# Altium schematic sheet 3.3V_1A_LDO_SUPPLY.SchDoc
size A
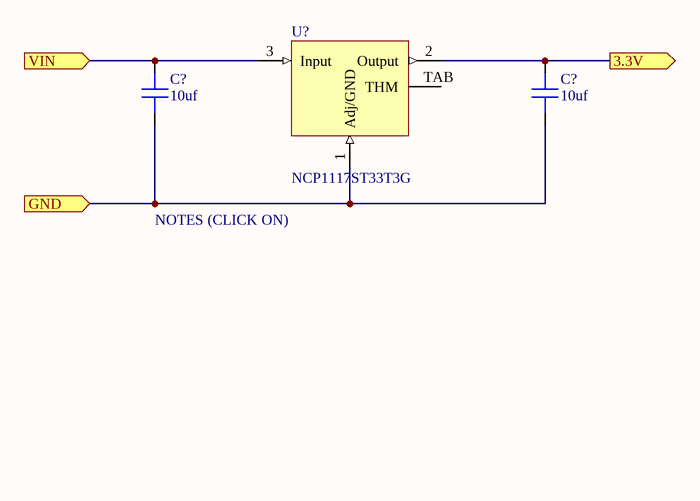
[diagram p0: 3.3V_1A_LDO_SUPPLY.SchDoc]

## Parts
(Parts that share a designator on the sheet are numbered #1, #2 ... from top to bottom, then left to right.)
C?#1  value 10uf  [CAP 0603/1608]  (hidden comment: Capacitor MLCC 10uf 16V CAP 0603/1608)
C?#2  value 10uf  [CAP 0603/1608]  (hidden comment: Capacitor MLCC 10uf 16V CAP 0603/1608)
U?  NCP1117ST33T3G  [SOT-223-3]

## Ports
3.3V (out), GND (in), VIN (in)

## Nets
3.3V: C?#2.2 U?.2(Output) ; port 3.3V
GND: C?#1.1 C?#2.1 U?.1(Adj/GND) ; port GND
VIN: C?#1.2 U?.3(Input) ; port VIN

Not connected (* = marked no-connect by the designer): U? TAB(THM)

## Notes on the sheet
- NOTES (CLICK ON)
- VOUT Stability BEST @ 7V
  Input is variable between 6.5 to 12V.
  DO NOT EXCEED 1A @ 12V
- Frequency compensation for the regulator is provided by capacitor Cout and its use is mandatory to ensure output stability. A minimum capacitance value of 4.7 F with an equivalent series resistance (ESR) that is within the limits of 33 mOhm (typ) to 2.2Ohm is required
- The input bypass capacitor should be mounted with the shortest
  possible track length directly across the regulator’s input
  and ground terminals. A 10 F ceramic or tantalum
  capacitor should be adequate for most applications.
- This series contains an internal thermal limiting circuit
  that is designed to protect the regulator in the event that the maximum junction temperature is exceeded. When
  activated, typically at 175°C, the regulator output switches off and then back on as the die cools. As a result, if the device is continuously operated in an overheated condition, the output will appear to be oscillating.

## Library data of the parts
C?#1 C?#2 = 235: Manufacturer_id: 1; idCapacitor: 235; Name: Cap_10uf_16V_CAP 0603/1608; Dielectric: Ceramic; Created_By: Nick Mah; Drawer_id: 1; Voltage_Rating: 16V; Package: CAP 0603/1608; Created_Date: 10/20/2018
U? = 15: 1.0 A Low Dropout Positive and Adjustable Voltage Regulator; Manufacturer_id: 1; idPMIC_Lin: 15; Name: 3.3V 1.0A LDO; Value: 3.3V 1.0A; Vin(Max): 20V; Vout(Max): 3.3V; Current_Rating: 1A; Dropout_Voltage: 1.2V @ 800mA; Drawer_id: 1; Num_Outputs: 1; Package: SOT-223-3; MfrPartNo: NCP1117ST33T3G; Link: https://www.digikey.com/product-detail/en/on-semiconductor/NCP1117ST33T3G/NCP1117ST33T3GOSCT-ND/660708?utm_adgroup=Integrated%20Circuits&slid=&gclid=CjwKCAjwpKveBRAwEiwAo4Pqm-q33kFM8zFNc6HZ2F-pR13_ETd6YlqjCAqcJjAXoyQWdArbQQWp4hoCk3EQAvD_BwE